# EAGLE design Power Supply Design (EAGLE 9.6.2)
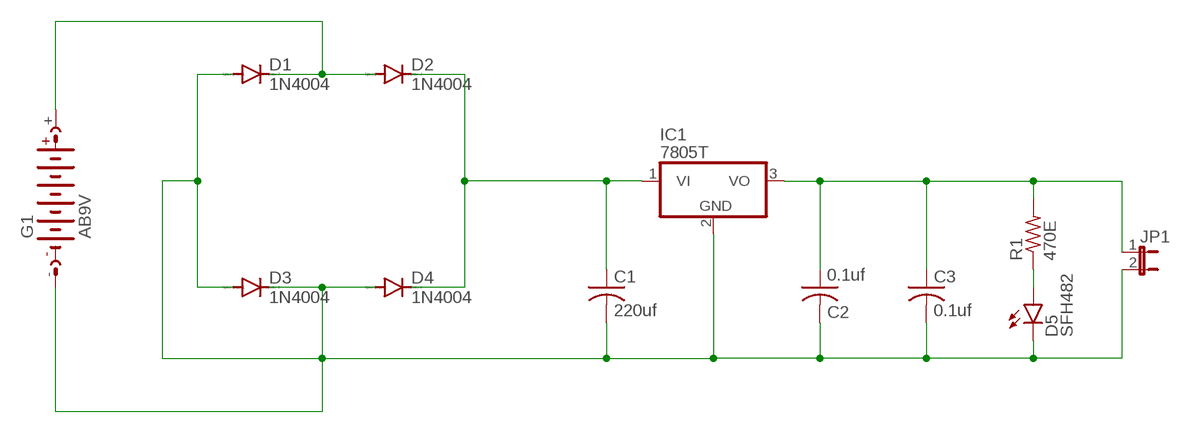
[diagram p0: schematic, sheet 1]

## Parts
C1  220uf  C-US050-030X075  [C050-030X075]
C2  0.1uf  C-US050-030X075  [C050-030X075]
C3  0.1uf  C-US050-030X075  [C050-030X075]
D1  1N4004  [DO41-10]
D2  1N4004  [DO41-10]
D3  1N4004  [DO41-10]
D4  1N4004  [DO41-10]
D5  SFH482  [SFH482]
G1  AB9V  [AB9V]
IC1  7805T  [TO220H]
JP1  JP1E  [JP1]
R1  470E  R-US_0204/7  [0204/7]

## Nets
N$1: D1.C D2.A G1.+
N$2: C1.1 D2.C D4.C IC1.1(VI)
N$3: C2.1 C3.1 IC1.3(VO) JP1.1 R1.2
N$4: D5.A R1.1
N$5: C1.2 C2.2 C3.2 D1.A D3.A D3.C D4.A D5.K(C) G1.- IC1.2(GND) JP1.2

## Library data of the parts
C1-C3 = rcl:C-US: CAPACITOR, American symbol; SPICEPREFIX: C
D1-D4 = diode:1N4004: DIODE general purpose rectifier, 1 A
D5 = led:SFH482: IR LED infrared emitting diode, Infineon
G1 = battery:AB9V: 9-V BATTERY CLIP
IC1 = linear:78*: Positive VOLTAGE REGULATOR Source: http://cache.national.com/ds/LM/LM78L05.pdf http://www.fairchildsemi.com/ds/LM/LM7805.pdf
JP1 = jumper:JP1E: JUMPER
R1 = rcl:R-US_: RESISTOR, American symbol; SPICEPREFIX: R

## Board
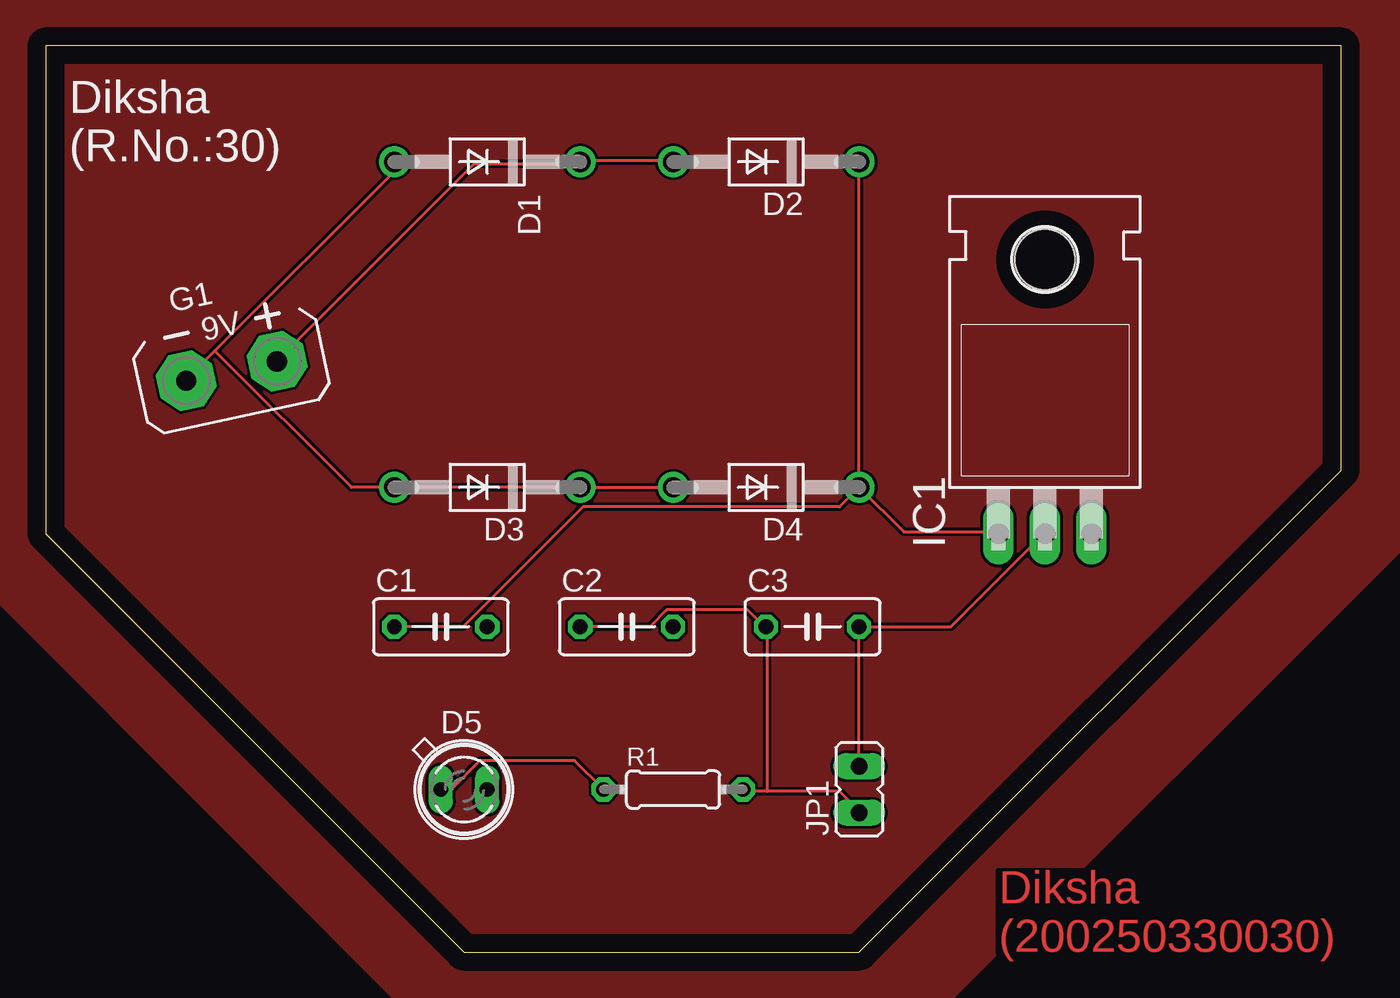
[diagram p1: board, top side]
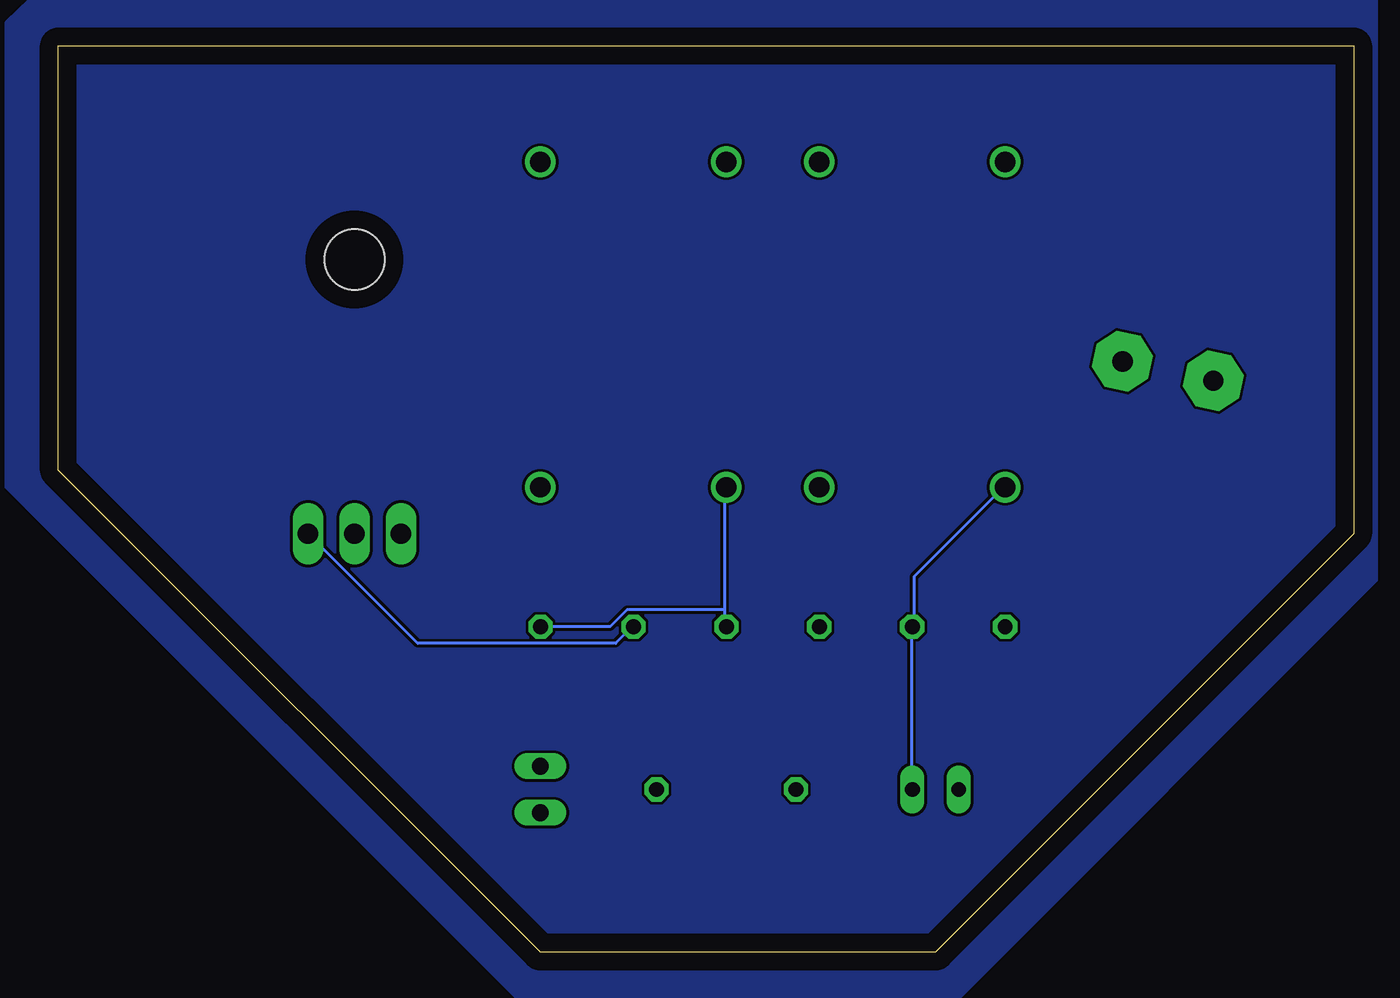
[diagram p2: board, bottom side, seen from below]

Size 70.79 x 49.52 mm. Coordinates in mm from the lower left corner, seen from the top.
Outline: 0,49.52 0,22.86 22.86,0 44.45,0 70.79,26.34 70.79,49.52 0,49.52
Copper layers (1*16): Top 0.035mm / dielectric 1.5mm / Bottom 0.035mm
Design rules "default": minimum track width 6mil, minimum drill 0.35mm, track to track 6mil, track to pad 6mil, pad to pad 6mil, via to via 6mil, smd to smd 6mil, copper to edge 40mil, drill to drill 6mil, minimum pad ring 10mil, minimum via ring 8mil, stop-mask expansion 4mil, vias tented up to drill 0mil, thermal gap 10mil

### Footprints (pad centres in the part's own frame; a part is rotated, then mirrored left to right if it is on the bottom)
C050-030X075 = drill 0.813 octagon: 1 -2.54,0; 2 2.54,0
DO41-10 = drill 1.118: A 5.08,0; C -5.08,0
SFH482 = drill 0.813 long: A -1.27,0; K 1.27,0
AB9V = drill 1.118 pad 3.15 octagon: + 0,2.54; - 0,-2.54
TO220H = drill 1.118 long: 1 -2.54,-10.16; 2 0,-10.16; 3 2.54,-10.16 | hole 3.302: 0,4.826
JP1 = drill 0.914 long: 1 0,-1.27; 2 0,1.27
0204/7 = drill 0.813 octagon: 1 -3.81,0; 2 3.81,0

### Placement (x,y rotation side)
C1  21.59,17.78 0 top
C2  31.75,17.78 0 top
C3  41.91,17.78 0 top
D1  24.13,43.18 180 top
D2  39.37,43.18 180 top
D3  24.13,25.4 180 top
D4  39.37,25.4 180 top
D5  22.86,8.89 0 top
G1  10.16,31.75 282.1 top
IC1  54.61,33.02 0 top
JP1  44.45,8.89 0 top
R1  34.29,8.89 0 top

### Tracks (layer width: path | path; a pad name or v marks a point on that pad's centre or on a via)
C1
  pour Bottom: -1.27,52.07 72.39,52.07 73.66,50.8 73.66,25.4 45.72,-2.54 43.18,-2.54 21.59,-2.54 -1.27,20.32 -1.27,21.59
  pour Top: -2.54,53.34 73.66,53.34 76.2,50.8 76.2,24.13 46.99,-5.08 21.59,-5.08 -2.54,19.05
N$1
  Top 0.152: D2.A 34.24,43.23 29.21,43.23 D1.C 29.21,43.08 23.42,43.08 12.75,32.41 G1.+
N$2
  Top 0.152: C1.1 22.81,17.78 29.36,24.33 43.38,24.33 D4.C | D4.C 46.89,22.96 52.07,22.96 IC1.1 | D4.C D2.C
N$3
  Top 0.152: 39.42,8.79 43.38,8.79 44.45,7.72 JP1.1 | 39.42,8.79 38.2,8.79 R1.2 | C2.1 33.02,17.78 33.93,18.69 38.35,18.69 39.27,17.78 C3.1 39.42,17.78 39.42,8.79
  Bottom 0.152: IC1.3 51.16,16.87 40.34,16.87 39.42,17.78 C3.1
N$4
  Top 0.152: R1.1 28.9,10.46 23.72,10.46 22.2,8.94 21.59,8.94 D5.A
N$5
  Top 0.152: 9.25,32.87 7.72,31.34 G1.- | 9.25,32.87 19,42.62 19,43.08 D1.A | JP1.2 C3.2 49.48,17.78 54.51,22.81 IC1.2 | D4.A D3.C D3.A 16.71,25.4 9.25,32.87
  Bottom 0.152: 34.39,18.69 34.39,25.4 D4.A | 34.39,18.69 34.39,17.78 C2.2 | D5.K 24.18,8.94 24.18,17.78 C1.2 24.03,17.78 24.03,20.52 19.15,25.4 D3.A | C3.2 40.64,17.78 39.73,18.69 34.39,18.69

### Text on the board
Top: Diksha / (200250330030)
tPlace: Diksha / (R.No.:30)